# Altium schematic sheet ws2812_column.SchDoc
size A4; SheetNumber: 5; SheetTotal: 7
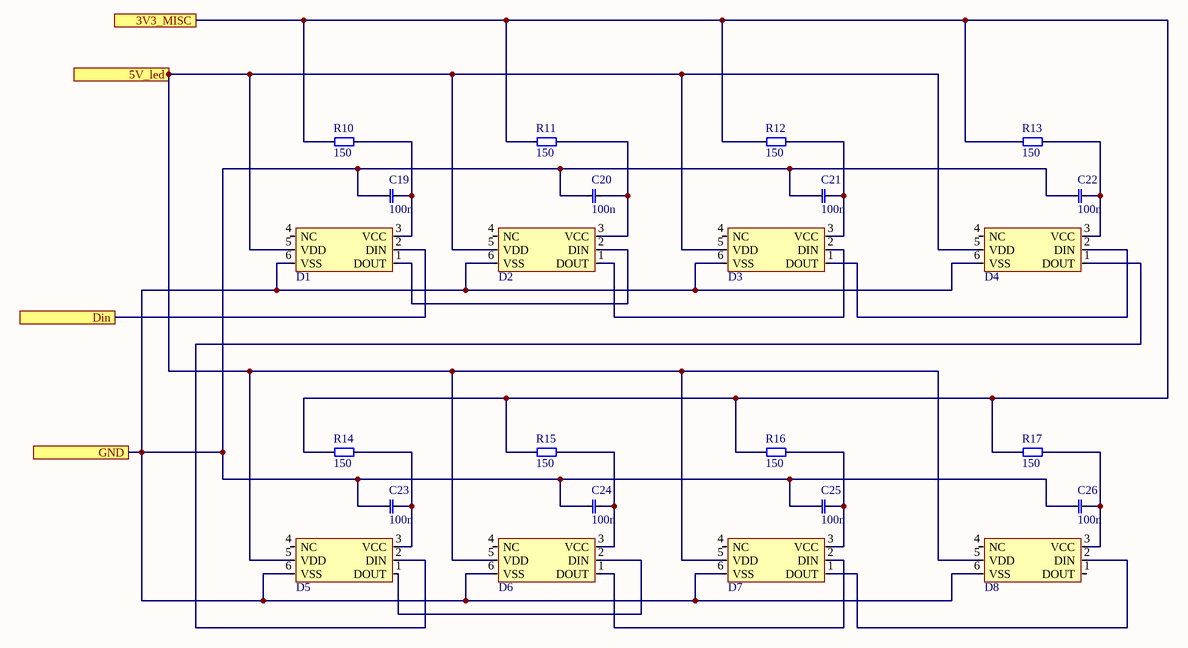
[diagram p0: ws2812_column.SchDoc]

## Parts
C19  value 100n  [1206, capasitor]  (hidden comment: 1206, capacitor)
C20  value 100n  [1206, capasitor]  (hidden comment: 1206, capacitor)
C21  value 100n  [1206, capasitor]  (hidden comment: 1206, capacitor)
C22  value 100n  [1206, capasitor]  (hidden comment: 1206, capacitor)
C23  value 100n  [1206, capasitor]  (hidden comment: 1206, capacitor)
C24  value 100n  [1206, capasitor]  (hidden comment: 1206, capacitor)
C25  value 100n  [1206, capasitor]  (hidden comment: 1206, capacitor)
C26  value 100n  [1206, capasitor]  (hidden comment: 1206, capacitor)
D1  Neo - WS2812  [NEOPIXEL]  (value not drawn)
D2  Neo - WS2812  [NEOPIXEL]  (value not drawn)
D3  Neo - WS2812  [NEOPIXEL]  (value not drawn)
D4  Neo - WS2812  [NEOPIXEL]  (value not drawn)
D5  Neo - WS2812  [NEOPIXEL]  (value not drawn)
D6  Neo - WS2812  [NEOPIXEL]  (value not drawn)
D7  Neo - WS2812  [NEOPIXEL]  (value not drawn)
D8  Neo - WS2812  [NEOPIXEL]  (value not drawn)
R10  value 150  [1206]  (hidden comment: 1206, resistor)
R11  value 150  [1206]  (hidden comment: 1206, resistor)
R12  value 150  [1206]  (hidden comment: 1206, resistor)
R13  value 150  [1206]  (hidden comment: 1206, resistor)
R14  value 150  [1206]  (hidden comment: 1206, resistor)
R15  value 150  [1206]  (hidden comment: 1206, resistor)
R16  value 150  [1206]  (hidden comment: 1206, resistor)
R17  value 150  [1206]  (hidden comment: 1206, resistor)

## Ports
3V3_MISC, 5V_led, Din, GND

## Nets
3V3_MISC: R10.1 R11.1 R12.1 R13.1 R14.1 R15.1 R16.1 R17.1 ; port 3V3_MISC
5V_led: D1.5(VDD) D2.5(VDD) D3.5(VDD) D4.5(VDD) D5.5(VDD) D6.5(VDD) D7.5(VDD) D8.5(VDD) ; port 5V_led
Din: D1.2(DIN) ; port Din
GND: C19.0 C20.0 C21.0 C22.0 C23.0 C24.0 C25.0 C26.0 D1.6(VSS) D2.6(VSS) D3.6(VSS) D4.6(VSS) D5.6(VSS) D6.6(VSS) D7.6(VSS) D8.6(VSS) ; port GND
NetC19_1: C19.1 D1.3(VCC) R10.0
NetC20_1: C20.1 D2.3(VCC) R11.0
NetC21_1: C21.1 D3.3(VCC) R12.0
NetC22_1: C22.1 D4.3(VCC) R13.0
NetC23_1: C23.1 D5.3(VCC) R14.0
NetC24_1: C24.1 D6.3(VCC) R15.0
NetC25_1: C25.1 D7.3(VCC) R16.0
NetC26_1: C26.1 D8.3(VCC) R17.0
NetD1_1: D1.1(DOUT) D2.2(DIN)
NetD2_1: D2.1(DOUT) D3.2(DIN)
NetD3_1: D3.1(DOUT) D4.2(DIN)
NetD4_1: D4.1(DOUT) D5.2(DIN)
NetD5_1: D5.1(DOUT) D6.2(DIN)
NetD6_1: D6.1(DOUT) D7.2(DIN)
NetD7_1: D7.1(DOUT) D8.2(DIN)

Not connected (* = marked no-connect by the designer): D1 4(NC); D2 4(NC); D3 4(NC); D4 4(NC); D5 4(NC); D6 4(NC); D7 4(NC); D8 1(DOUT) 4(NC)

## Library data of the parts
R10-R17 = 1206, resistor: Resistor; DigiKey: RMCF1206JT150RCT-ND
C19-C26 = 1206, capacitor: DigiKey: 399-C1206C104M5RACAUTOCT-ND
D1-D8 = Neo - WS2812: Value: WS2812; DigiKey: 1568-1800-ND